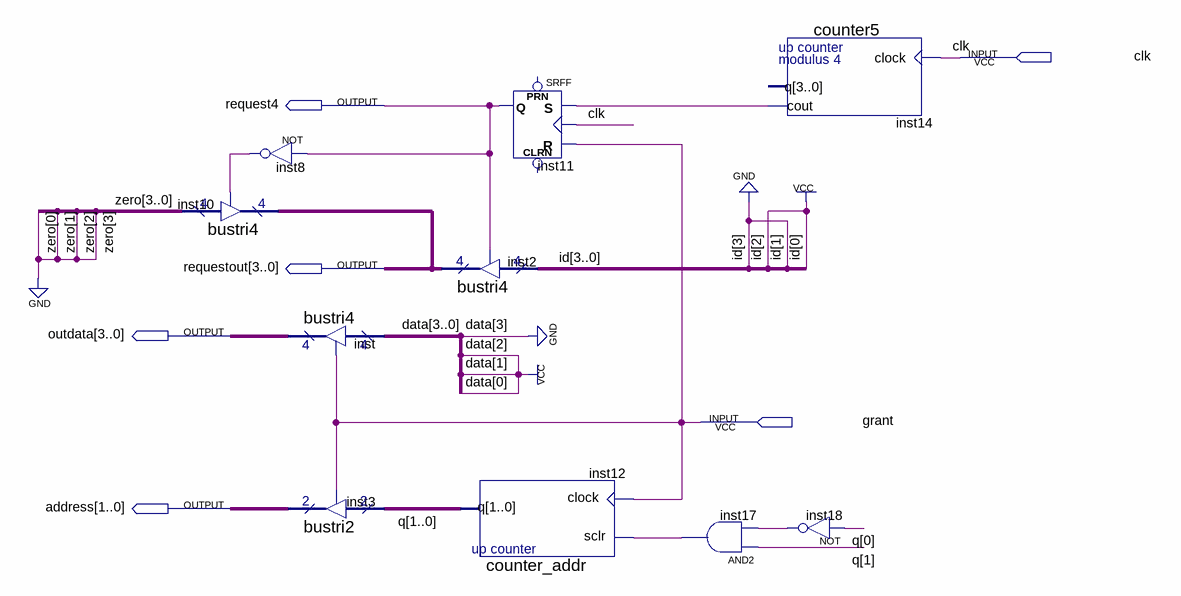
[diagram p0: schematic sheet]
// Quartus schematic master5.bdf as structural Verilog: 10 symbols, 6 pins
module master5 (
  input  clk,
  input  grant,
  output request4,
  output [3:0] requestout,
  output [3:0] outdata,
  output [1:0] address
);

  wire inst8_out, inst14_cout, inst17_out, inst18_out;
  wire [1:0] q;

  bustri4 inst10 (.enabledt(inst8_out), .data(4'b0000), .tridata(requestout));
  not inst8 (inst8_out, request4);
  bustri4 inst (.enabledt(grant), .data(4'b0111), .tridata(outdata));
  bustri2 inst3 (.enabledt(grant), .data(q), .tridata(address));
  SRFF inst11 (.S(inst14_cout), .R(grant), .CLK(clk), .Q(request4));  // open: PRN, CLRN
  bustri4 inst2 (.enabledt(request4), .data(4'b0101), .tridata(requestout));
  counter_addr inst12 (.sclr(inst17_out), .clock(grant), .q(q));
  and inst17 (inst17_out, q[1], inst18_out);
  counter5 inst14 (.clock(clk), .cout(inst14_cout));  // open: q
  not inst18 (inst18_out, q[0]);
endmodule
